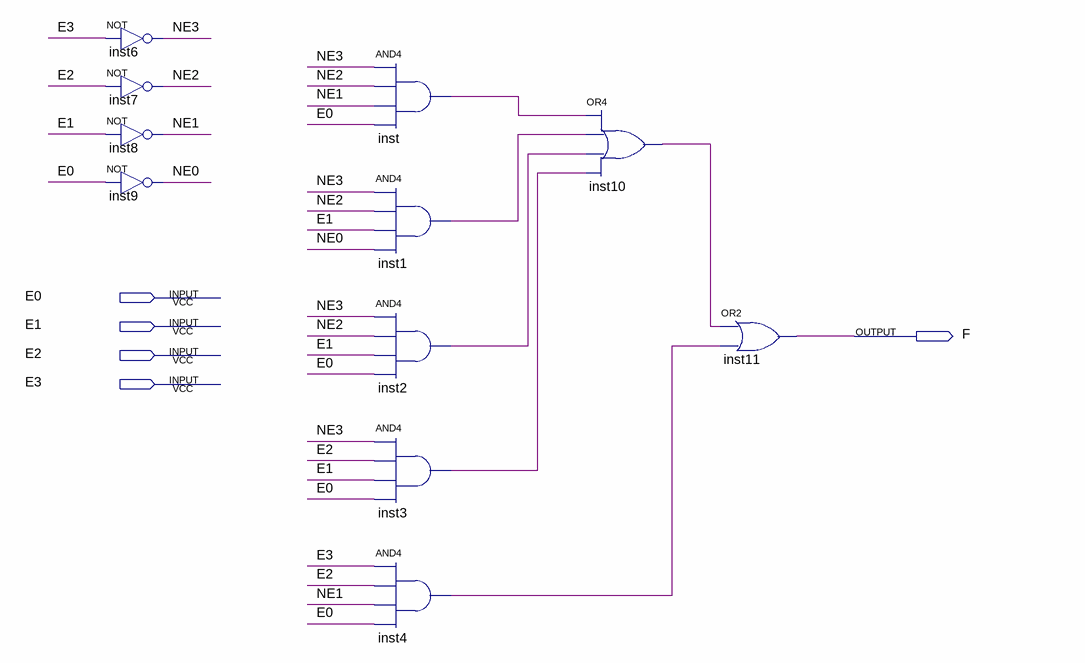
[diagram p0: schematic sheet]
// Quartus schematic F.bdf as structural Verilog: 11 symbols, 5 pins
module F (
  input  E0,
  input  E1,
  input  E2,
  input  E3,
  output F
);

  wire inst1_out, inst2_out, inst3_out, inst4_out, inst10_out, inst_out, NE0, NE1, NE2, NE3;

  not inst6 (NE3, E3);
  not inst7 (NE2, E2);
  not inst8 (NE1, E1);
  not inst9 (NE0, E0);
  and inst (inst_out, NE3, NE2, NE1, E0);
  and inst1 (inst1_out, NE3, NE2, E1, NE0);
  and inst2 (inst2_out, NE3, NE2, E1, E0);
  and inst3 (inst3_out, NE3, E2, E1, E0);
  and inst4 (inst4_out, E3, E2, NE1, E0);
  or inst10 (inst10_out, inst_out, inst1_out, inst2_out, inst3_out);
  or inst11 (F, inst10_out, inst4_out);
endmodule
